# Altium schematic sheet Convert_Board.SchDoc
size A3; DocumentNumber: 6; SheetNumber: 6; SheetTotal: 6; PageSetup: Record=PageOptions|CenterHorizontal=True|CenterVertical=True|PrintScale=1.07|XCorrection=1.00|YCorrection=1.00|PrintKind=1|BorderSize=5000000|LeftOffset=0|BottomOffset=0|Orientation=2|PaperLength=1000|PaperWidth=1000|Scale=100|PaperSource=7|PrintQuality=600|MediaType=1|DitherType=10|PaperKind=A3|PrintScaleMode=1
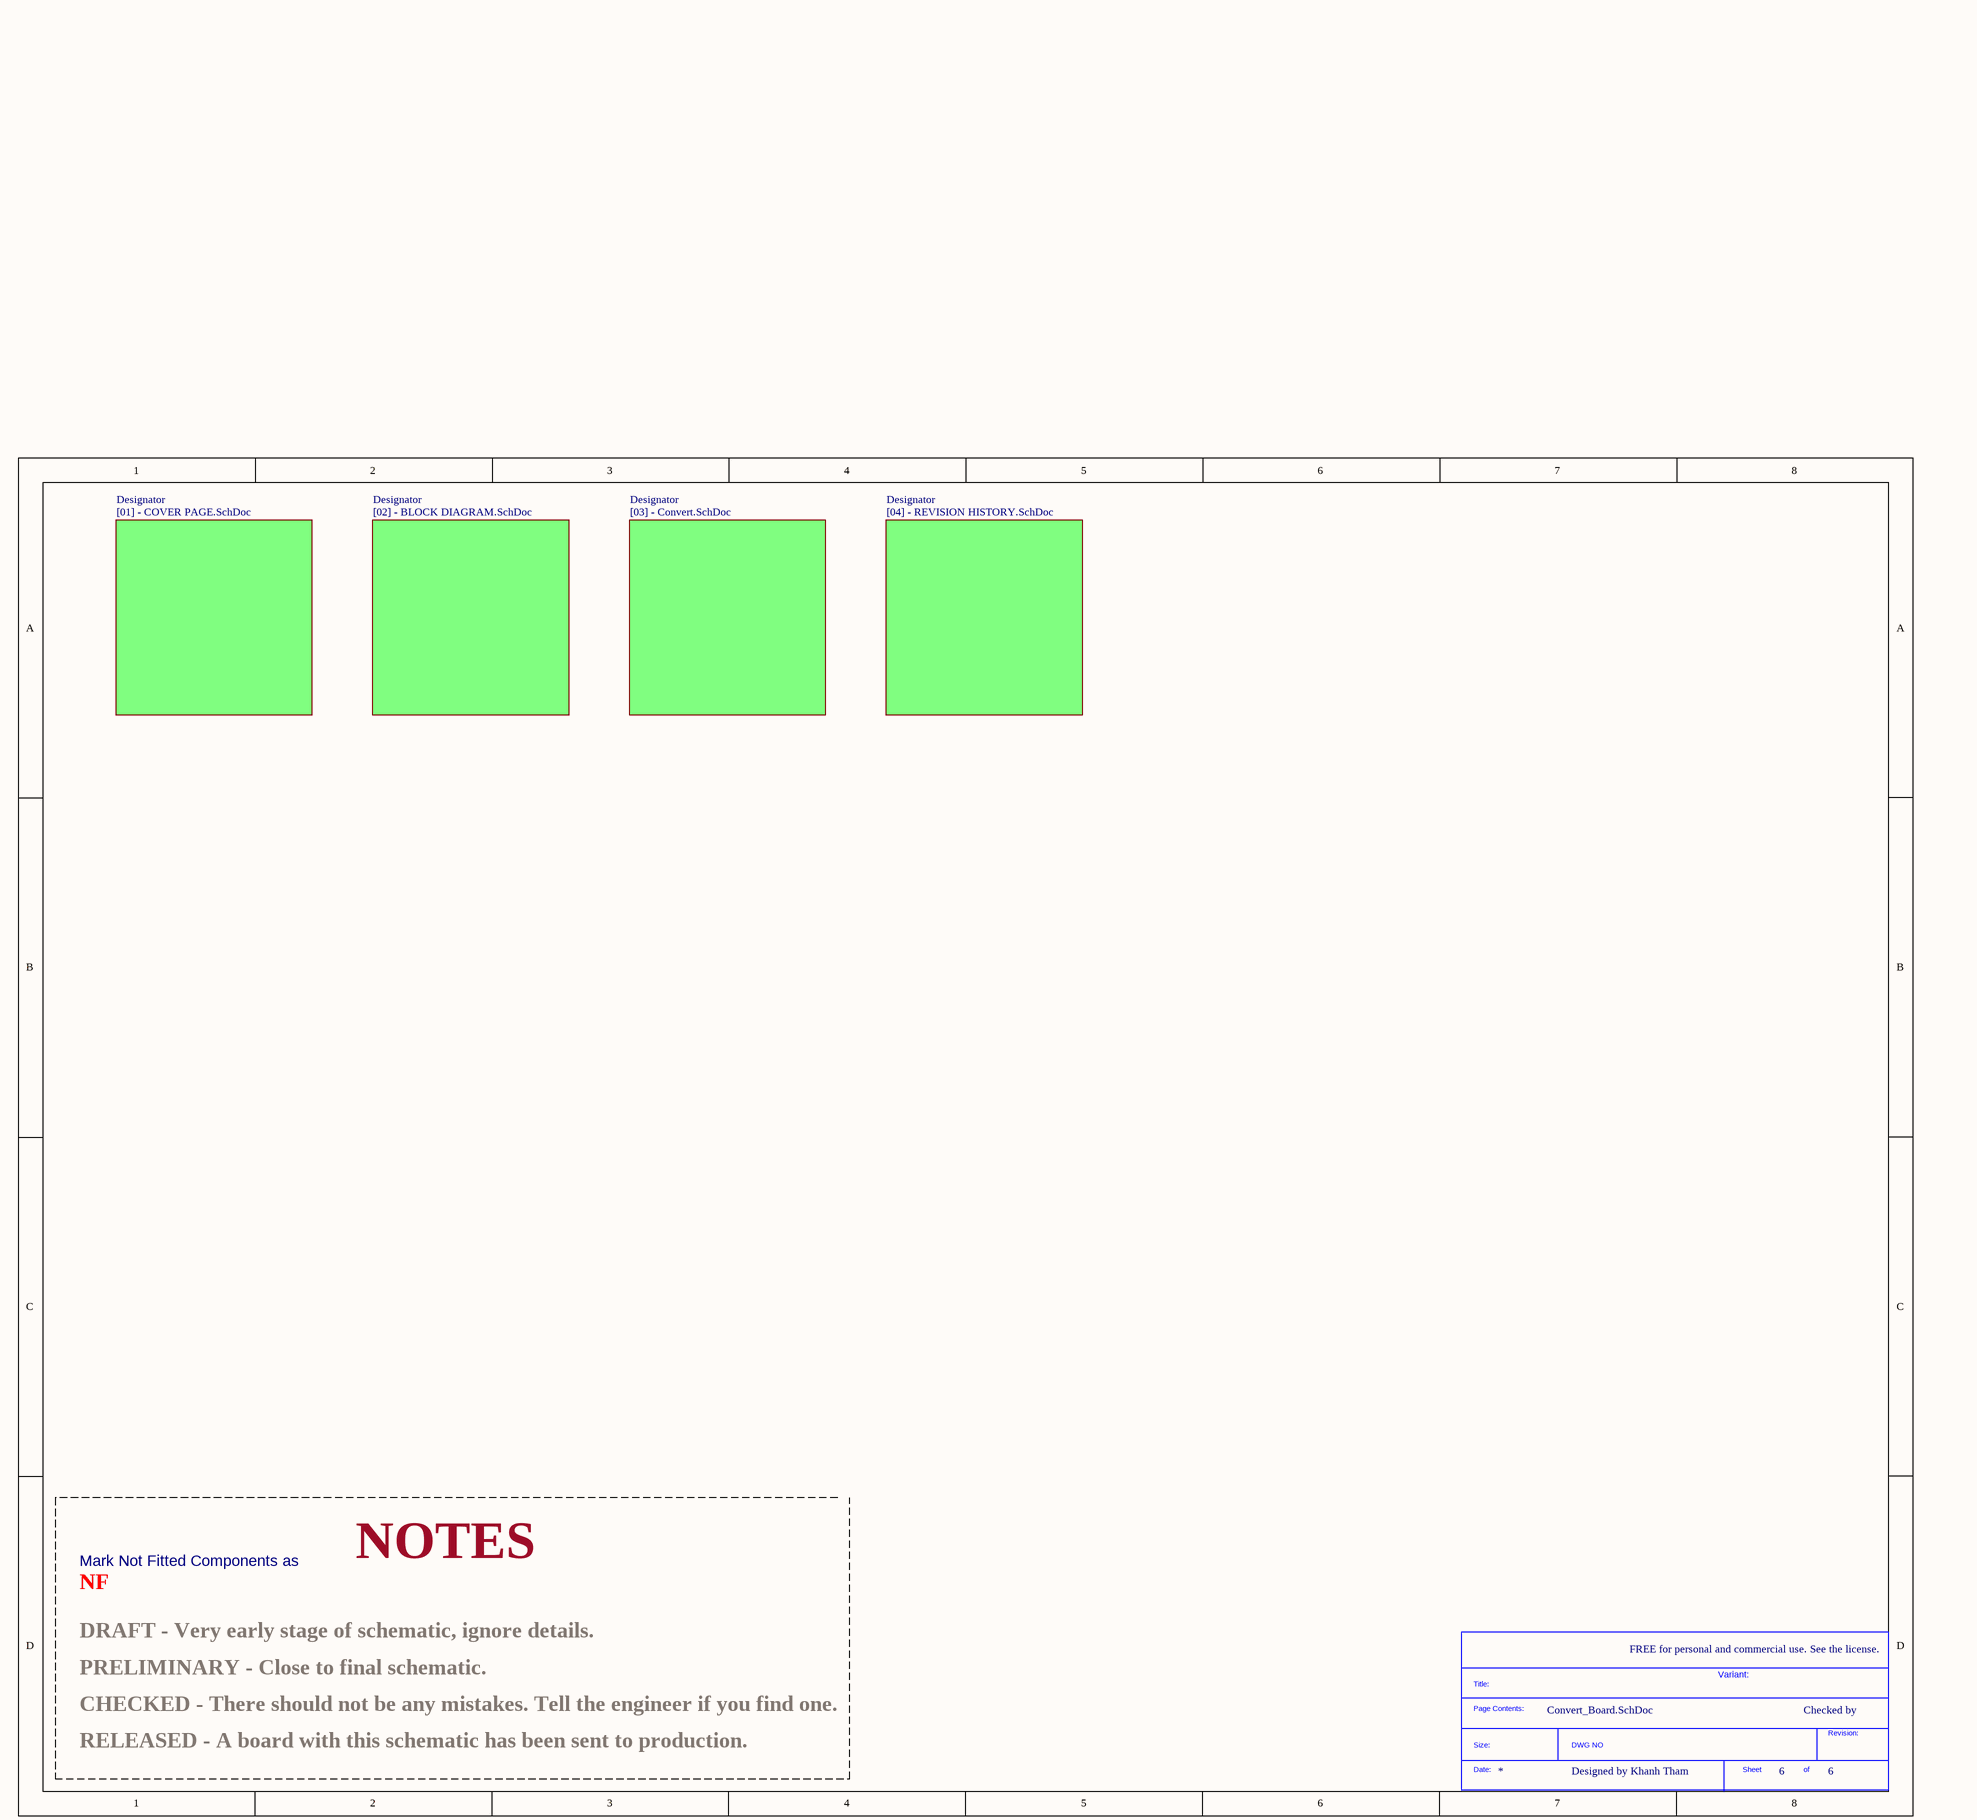
[diagram p0: Convert_Board.SchDoc]

## Parts
*  SDTitleBlock  (value not drawn)  (graphical)

## Sub-sheets
Designator = [01] - COVER PAGE.SchDoc: no entries
Designator = [02] - BLOCK DIAGRAM.SchDoc: no entries
Designator = [03] - Convert.SchDoc: no entries
Designator = [04] - REVISION HISTORY.SchDoc: no entries

## Notes on the sheet
- NF
- Mark Not Fitted Components as
- NOTES
- DRAFT - Very early stage of schematic, ignore details.
- FREE for personal and commercial use. See the license.
- PRELIMINARY - Close to final schematic.
- CHECKED - There should not be any mistakes. Tell the engineer if you find one.
- Variant:
- Checked by
- RELEASED - A board with this schematic has been sent to production.
- Designed by Khanh Tham
- (in symbol SDTitleBlock) Title:; Page Contents:; Revision:; Size:; DWG NO; Date:; Sheet; of